# Altium schematic sheet voting machine.SchDoc
size 420 x 297 mm; SheetNumber: 1; SheetTotal: 1
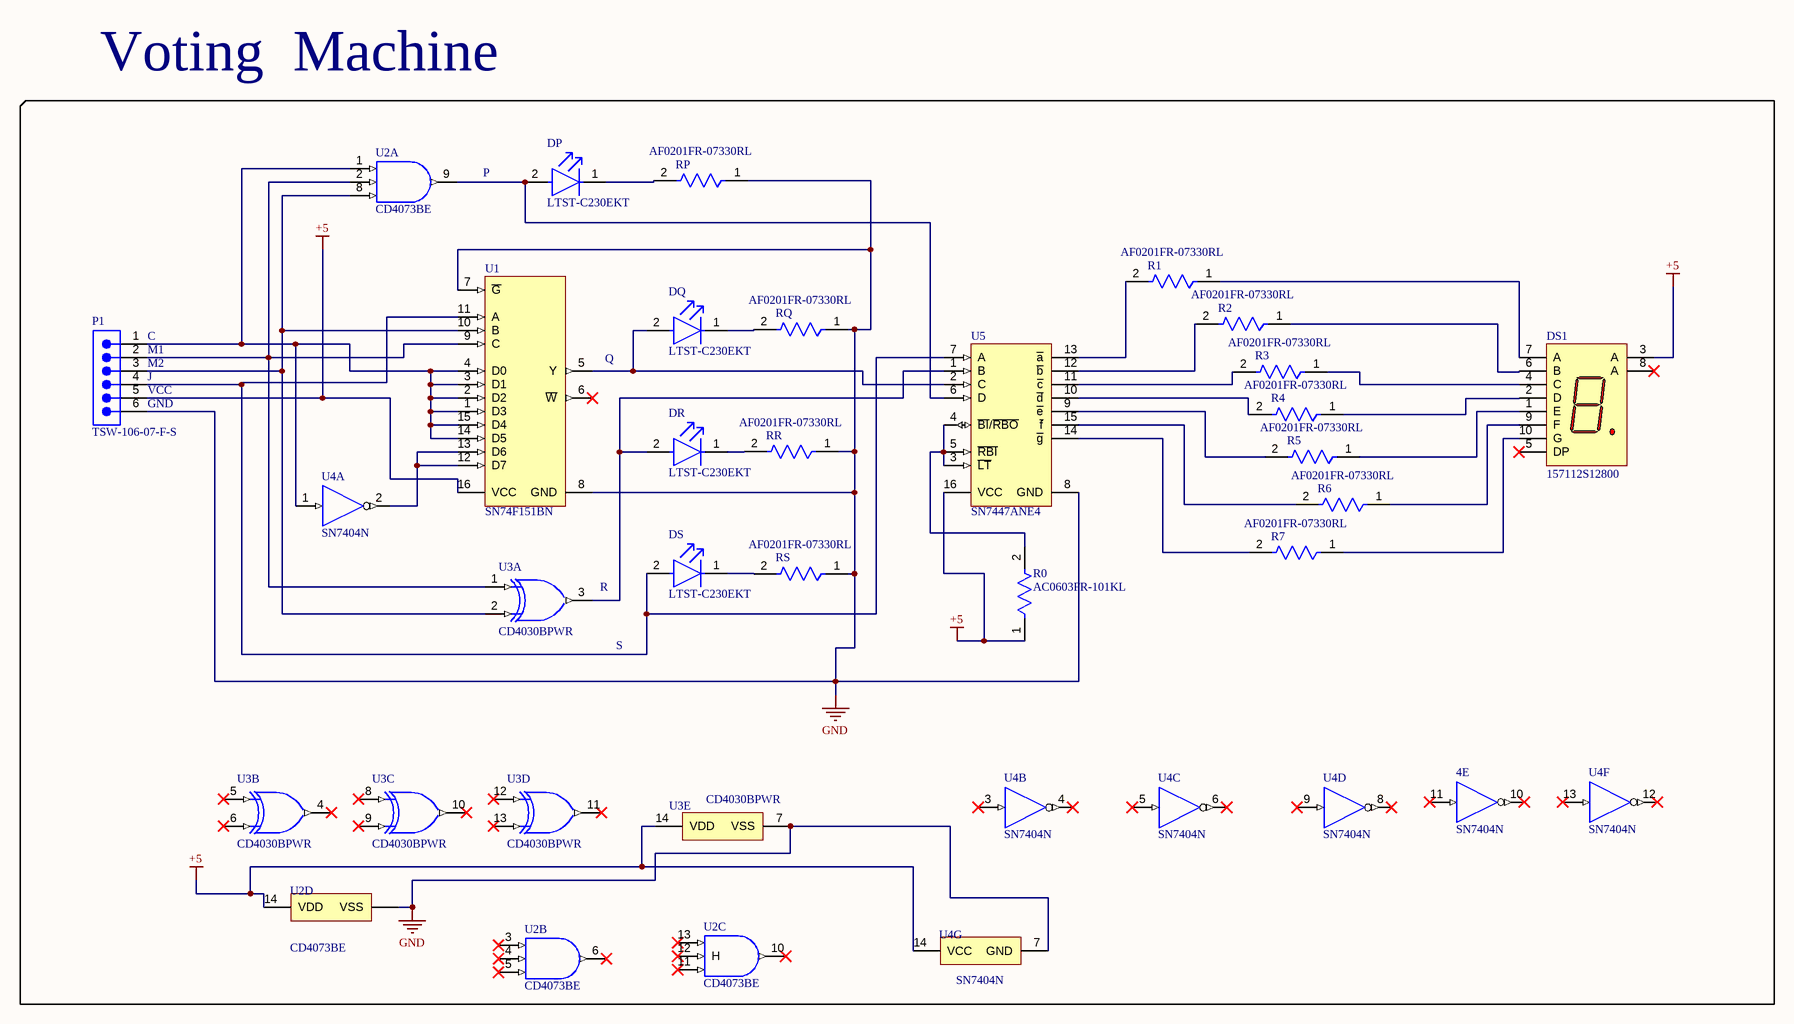
[diagram p0: voting machine.SchDoc]

## Parts
4  SN7404N  [N0014A]  (part E of 7)
DP  LTST-C230EKT  [FP-LTST-C230EKT-MFG]
DQ  LTST-C230EKT  [FP-LTST-C230EKT-MFG]
DR  LTST-C230EKT  [FP-LTST-C230EKT-MFG]
DS  LTST-C230EKT  [FP-LTST-C230EKT-MFG]
DS1  157112S12800  [WL-S7DS_L12W7.3H3.75]
P1  TSW-106-07-F-S  [SMTC-TSW-106-07-X-S]
R0  AC0603FR-101KL  [FP-AC0603-IPC_C]
R1  AF0201FR-07330RL  [FP-AF0201-MFG]
R2  AF0201FR-07330RL  [FP-AF0201-MFG]
R3  AF0201FR-07330RL  [FP-AF0201-MFG]
R4  AF0201FR-07330RL  [FP-AF0201-MFG]
R5  AF0201FR-07330RL  [FP-AF0201-MFG]
R6  AF0201FR-07330RL  [FP-AF0201-MFG]
R7  AF0201FR-07330RL  [FP-AF0201-MFG]
RP  AF0201FR-07330RL  [FP-AF0201-MFG]
RQ  AF0201FR-07330RL  [FP-AF0201-MFG]
RR  AF0201FR-07330RL  [FP-AF0201-MFG]
RS  AF0201FR-07330RL  [FP-AF0201-MFG]
U1  SN74F151BN  [N0016A]
U2  CD4073BE  [N0014A]  (parts A,B,C,D of 4)
U3  CD4030BPWR  [PW0014A_M]  (parts A,B,C,D,E of 5)
U4  SN7404N  [N0014A]  (parts A,B,C,D,F,G of 7)
U5  SN7447ANE4  [TI-N16]

## Nets
+5: DS1.3(A) P1.5 R0.1 U1.16(VCC) U2.14(VDD) U3.14(VDD) U4.14(VCC) U5.16(VCC)
GND: P1.6 RP.1 RQ.1 RR.1 RS.1 U1.7(~{G}) U1.8(GND) U2.7(VSS) U3.7(VSS) U4.7(GND) U5.8(GND)
NetDP_1: DP.1(C) RP.2
NetDP_2: DP.2(A) U2.9(J) U5.6(D)
NetDQ_1: DQ.1(C) RQ.2
NetDQ_2: DQ.2(A) U1.5(Y) U5.2(C)
NetDR_1: DR.1(C) RR.2
NetDR_2: DR.2(A) U3.3(J) U5.1(B)
NetDS1_1: DS1.1(E) R5.1
NetDS1_2: DS1.2(D) R4.1
NetDS1_4: DS1.4(C) R3.1
NetDS1_6: DS1.6(B) R2.1
NetDS1_7: DS1.7(A) R1.1
NetDS1_9: DS1.9(F) R6.1
NetDS1_10: DS1.10(G) R7.1
NetDS_1: DS.1(C) RS.2
NetDS_2: DS.2(A) P1.4 U1.11(A) U5.7(A)
NetP1_1: P1.1 U1.1(D3) U1.2(D2) U1.3(D1) U1.4(D0) U1.14(D5) U1.15(D4) U2.1(A) U4.1(1A)
NetP1_2: P1.2 U1.9(C) U2.2(B) U3.1(A)
NetP1_3: P1.3 U1.10(B) U2.8(C) U3.2(B)
NetR0_2: R0.2 U5.3(~{LT}) U5.4(~{BI}/~{RBO}) U5.5(~{RBI})
NetR1_2: R1.2 U5.13(~{a})
NetR2_2: R2.2 U5.12(~{b})
NetR3_2: R3.2 U5.11(~{c})
NetR4_2: R4.2 U5.10(~{d})
NetR5_2: R5.2 U5.9(~{e})
NetR6_2: R6.2 U5.15(~{f})
NetR7_2: R7.2 U5.14(~{g})
NetU1_12: U1.12(D7) U1.13(D6) U4.2(~{1Y})

Not connected (* = marked no-connect by the designer): 4 10(~{5Y})* 11(5A)*; DS1 5(DP)* 8(A)*; U1 6(~{W})*; U2 3(D)* 4(E)* 5(F)* 6(K)* 10(L)* 11(I)* 12(H)* 13(G)*; U3 4(K)* 5(C)* 6(D)* 8(E)* 9(F)* 10(L)* 11(M)* 12(G)* 13(H)*; U4 3(2A)* 4(~{2Y})* 5(3A)* 6(~{3Y})* 8(~{4Y})* 9(4A)* 12(~{6Y})* 13(6A)*

## Notes on the sheet
- Voting  Machine
- P
- (near P1) C
- (near P1) M1
- (near P1) M2
- (near U1) Q
- (near P1) J
- (near P1) VCC
- (near P1) GND
- (near U3) R
- S
- THIS DOCUMENT AND THE DATA DISCLOSED HEREIN OR
- HEREWITH IS THE PROPERTY OF ALTIUM LIMITED AND MAY
- DWG NO:
- REVISION
- REV:
- DESCRIPTION
- DATE
- APPROVED
- BE FREELY DISTRIBUTED IN WHOLE. NO RIGHTS ARE
- RESERVED OR EXPRESS OR IMPLIED WARANTEE GIVEN.
- ENG:
- APPROVALS
- PROJECT
- DSN:
- CHK:
- REFERENCE DOCUMENTS
- PROJECT REVISION:
- TITLE
- DOCUMENT REVISION:
- DESIGN ITEM:
- BOM:
- FAB DWG:
- PCB DWG:
- ASSY DWG:
- SCALE:
- A3
- SIZE
- CAGE CODE
- FILE NAME
- DWG NO.
- SHEET
- OF
- REV

## Library data of the parts
4 U4 = CMP-1615-00872-2: Hex inverters, N0014A, TUBE; Generic Part Number: SN7404; Manufacturer: Texas Instruments; Voltage(Nom)(V): 5; Bits(#): 6; tpd @ Nom Voltage(Max)(ns): 22; Schmitt Trigger: No; VCC(Max)(V): 5.25; ICC @ Nom Voltage(Max)(mA): 0.033; Technology Family: TTL; Rating: Catalog; F @ Nom Voltage(Max)(Mhz): 35; Output Type: CMOS; VCC(Min)(V): 4.75; Output Drive (IOL/IOH)(Max)(mA): -0.4/16; DatasheetVersion: SDLS029C; Code_JEDEC: MS-001; Operating Temperature Range(C): 0 to 70; PackageReference: N0014A; Input Type: TTL
DP DQ DR DS = CMP-22017-000030-1: LED RED CLEAR CHIP SMD; Forward Current: 30mA; Test Current: 10mA; Number of Elements: 1; Viewing Angle: 130°; Dominant Wavelength: 621nm; Forward Voltage: 2V; Lens Style: Diffused; Power Rating: 100mW; Reverse Voltage: 5V; Wavelength: 630nm; Luminous Intensity: 6mcd; Lens Color: Colorless; Case/Package: 1206; Case Code (Imperial): 1206; Package Quantity: 1; Lead Free: Lead Free; Case Code (Metric): 3216; Height: 1.1mm; Lens Transparency: Clear; Mount: Surface Mount; Depth: 1.6mm; Number of LEDs: 1; Power Dissipation: 100mW; Max Operating Temperature: 85°C; Width: 1.6mm; Color: Red; Number of Pins: 2; Min Operating Temperature: -55°C; Packaging: Tape and Reel; Radiation Hardening: No; Illumination Color: Red; Length: 3.2mm
DS1 = CMP-03913-119893987-3: 7-Seg Display, Comm Anode, Super Red Rohs Compliant: Yes; Forward Voltage: 2V; Dominant Wavelength: 635nm; Forward Current: 100mA; Luminous Intensity: 15mcd; Max Reverse Voltage (DC): 5V; Height: 3.75mm; Width: 7.3mm; Max Operating Temperature: 85°C; Length: 12mm; RoHS: Compliant; Min Operating Temperature: -35°C
P1 = CMP-1024-00385-1: 0.025" SQ Post Header, Through-hole, Vertical, -55 to 125 degC, 2.54 mm Pitch, 6-Pin, Male, RoHS; Manufacturer: Samtec; Pitch: 2.54 mm; Orientation: Vertical; RoHS: True; ComponentLink3Description: Package Specification; PartNumber: TSW-106-07-F-S; Temperature Range: -55 to 125 degC; PackageVersion: DM, 8/1988; ComponentLink2URL: http://www.samtec.com/documents/webfiles/pdf/TSW_TH.PDF; ComponentLink1Description: Manufacturer URL; ComponentLink2Description: Datasheet; ComponentLink1URL: http://www.samtec.com; DatasheetVersion: F-214; PackageReference: TSW-106-07-X-S; PackageDescription: .025[0.64] SQ. Post Terminal Strip Assembly; ComponentLink3URL: http://www.samtec.com/documents/webfiles/cpdf/TSW-XXX-XX-XXX-X-XX-XXX-MKT.pdf; Mounting Technology: Through-hole
R0 = CMP-03412-045511-1: RES 1kΩ 1.00% 0.1W 0603; Power Rating: 100mW; Resistance: 1kR; Tolerance: 1%; Temperature Coefficient: 100ppm/°C; Voltage Rating: 50V; Max Operating Temperature: 155°C; Height: 0.45mm; RoHS Compliant: Yes; Series: AC; Termination: SMD/SMT; Length: 1.6mm; Packaging: Tape and Reel; Case/Package: 0603; Case Code (Imperial): 0603; Min Operating Temperature: -55°C; Case Code (Metric): 1608; Width: 0.8mm
R1-R7 RP RQ RR RS = CMP-03412-043091-1: Anti-Sulfurated Chip Resistors Automotive Grade 330Ω 1% 200ppm/°C 0201; Max Power Dissipation: 50mW; Resistance: 330R; Series: AF; Tolerance: 1%; Resistor Type: Thick Film; Packaging: Tape and Reel; Features: Moisture Resistant; Temperature Coefficient: 200ppm/°C; Number of Terminations: 2; Max Operating Temperature: 125°C; Length: 0.024inch; RoHS Compliant: Yes; Width: 0.012inch; Min Operating Temperature: -55°C; Height: 0.01inch; Case/Package: 0201
U1 = CMP-1633-00607-2: 8-Line To 1-Line Data Selector/Multiplexer, N0016A, TUBE; Manufacturer: Texas Instruments; Rating: Catalog; Technology Family: F; Configuration: 8：1; Output Drive (IOL/IOH)(Max)(mA): 24/-1; VCC(Max)(V): 5.5; F @ Nom Voltage(Max)(Mhz): 70; Voltage(Nom)(V): 5; tpd @ Nom Voltage(Max)(ns): 9.5; Schmitt Trigger: No; Channels(#): 1; ICC @ Nom Voltage(Max)(mA): 21; Function: Encoder/Multiplexer; VCC(Min)(V): 4.5; Type: Standard; PackageReference: N0016A; Generic Part Number: SN74F151B; DatasheetVersion: SDFS023A; Operating Temperature Range(C): 0 to 70; Code_JEDEC: MS-001
U2 = CMP-0777-00285-3: CMOS Triple 3-Input AND Gate, N0014A, TUBE; Manufacturer: Texas Instruments; Technology Family: CD4000; tpd @ Nom Voltage(Max)(ns): 120; Voltage(Nom)(V): 10; Rating: Catalog; F @ Nom Voltage(Max)(Mhz): 8; Bits(#): 3; ICC @ Nom Voltage(Max)(mA): 0.025; Schmitt Trigger: No; VCC(Max)(V): 18; Input Type: CMOS; Operating Temperature Range(C): -55 to 125; PackageReference: N0014A; Output Type: CMOS; Generic Part Number: CD4073B; DatasheetVersion: SCHS057C; VCC(Min)(V): 3
U3 = CMP-0778-00137-3: CMOS Quad Exclusive-OR Gate, PW0014A, LARGE T&R; Manufacturer: Texas Instruments; tpd @ Nom Voltage(Max)(ns): 130; Rating: Military; Voltage(Nom)(V): 10; F @ Nom Voltage(Max)(Mhz): 8; Schmitt Trigger: No; Output Drive (IOL/IOH)(Max)(mA): 1.5/-1.5; Technology Family: CD4000; VCC(Max)(V): 18; VCC(Min)(V): 3; ICC @ Nom Voltage(Max)(mA): 0.015; Bits(#): 4; Output Type: CMOS; Generic Part Number: CD4030B; Operating Temperature Range(C): -55 to 125; Input Type: CMOS; PackageReference: PW0014A; DatasheetVersion: SCHS035C
U5 = CMP-0388-00311-1: BCD-to-7-Segment Decoder / Driver, 4.75 to 5.25 V, 0 to 70 degC, 16-pin DIP (N16), Pb-Free (RoHS); Manufacturer: Texas Instruments; Vin(Min)(V): 4.75; SubFamily: Discrete Segment LED Driver; Vin(Max)(V): 5.25; ComponentLink2URL: http://www.ti.com/general/docs/lit/getliterature.tsp?genericPartNumber=SN7447A&fileType=pdf; ComponentLink3Description: Package Specification; ComponentLink3URL: http://www.ti.com/litv/pdf/mpdi002c; ComponentLink1URL: http://www.ti.com/; PackageVersion: 4040049/E; Eco-Plan: Pb-Free (RoHS); Code_JEDEC: MS-001; PartNumber: SN7447ANE4; PackageDescription: 16-Pin Plastic In-Line, Body 19.305 x 6.35 mm, Pitch 2.54 mm; ComponentLink1Description: Manufacturer URL; DatasheetVersion: SDLS111; ComponentLink2Description: Datasheet; Mounting Technology: Through Hole; PackageReference: N16